# Altium schematic sheet Sch_OnAp_V1.SchDoc
size A; SheetNumber: 1; SheetTotal: 1
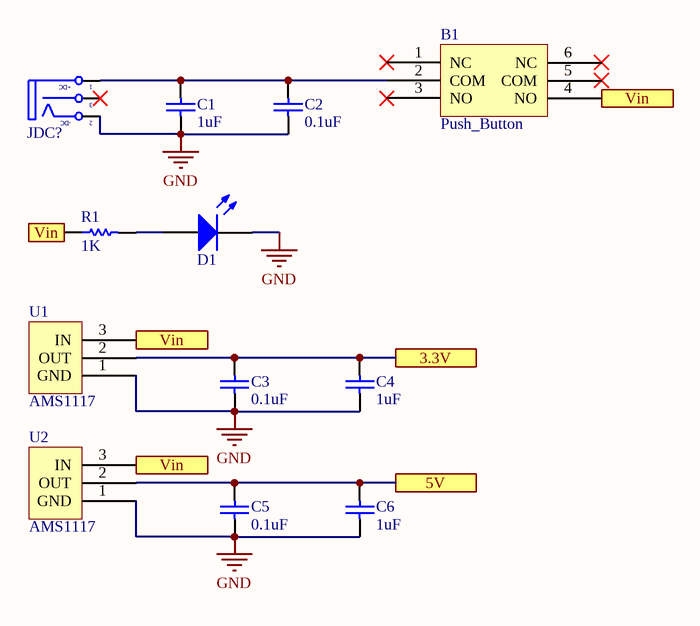
[diagram p0: Sch_OnAp_V1.SchDoc]

## Parts
B1  Push_Button  [Button_6Pin]
C1  value 1uF  [CAP-SM-0603]  (hidden comment: Cap Non-Pol SMD)
C2  C2: 0.1uF  [CAP-SM-0603]  (hidden comment: Cap Non-Pol SMD)
C3  value 0.1uF  [CAP-SM-0603]  (hidden comment: Cap Non-Pol SMD)
C4  value 1uF  [CAP-SM-0603]  (hidden comment: Cap Non-Pol SMD)
C5  value 0.1uF  [CAP-SM-0603]  (hidden comment: Cap Non-Pol SMD)
C6  value 1uF  [CAP-SM-0603]  (hidden comment: Cap Non-Pol SMD)
D1  LED SMD  [LED_0805_Blue]  (value not drawn)
JDC?  Jack DC  [DC-IN]  (value not drawn)
R1  value 1K  [RES-SM-0603]  (hidden comment: RESISTOR SMD)
U1  AMS1117  [AMS1117]
U2  AMS1117  [AMS1117]

## Ports
3.3V, 5V, Vin

## Nets
GND: C1.1 C2.1 C3.2 C4.2 C5.2 C6.1 D1.2(K) JDC?.2(TN) U1.1(GND) U2.1(GND)
3.3V: C3.1 C4.1 U1.2(OUT) ; port 3.3V
5V: C5.1 C6.2 U2.2(OUT) ; port 5V
Vin: B1.4(NO) R1.1 U1.3(IN) U2.3(IN) ; port Vin
NetB1_2: B1.2(COM) C1.2 C2.2 JDC?.1(T)
NetD1_1: D1.1(A) R1.2

Not connected (* = marked no-connect by the designer): B1 1(NC)* 3(NO)* 5(COM)* 6(NC)*; JDC? 3(S)*

## Notes on the sheet
- Template_A4
- Nguyen Van Son
- (in symbol Jack DC) +DC; -DC

## Library data of the parts
C1-C6 = Cap Non-Pol SMD: Capacitor
D1 = LED SMD: LED
JDC? = Jack DC: Jack DC input; Value: Jac DC
R1 = RESISTOR SMD: Resistor